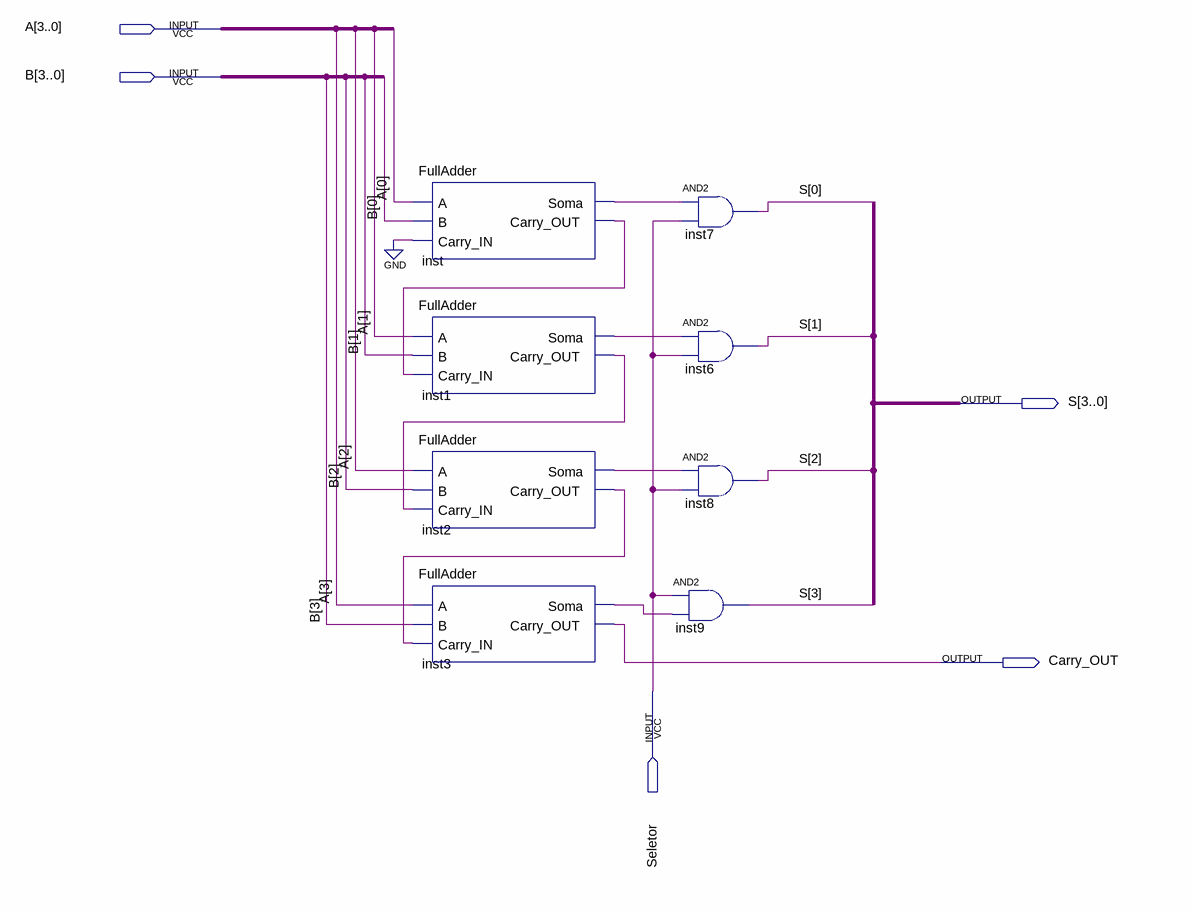
[diagram p0: schematic sheet]
// Quartus schematic Soma_4_bits.bdf as structural Verilog: 8 symbols, 5 pins
module Soma_4_bits (
  input  [3:0] A,
  input  [3:0] B,
  input  Seletor,
  output [3:0] S,
  output Carry_OUT
);

  wire inst1_carry_out, inst1_soma, inst2_carry_out, inst2_soma, inst3_soma, inst_carry_out, inst_soma;

  FullAdder inst (.A(A[0]), .B(B[0]), .Carry_IN(1'b0), .Soma(inst_soma), .Carry_OUT(inst_carry_out));
  FullAdder inst1 (.A(A[1]), .B(B[1]), .Carry_IN(inst_carry_out), .Soma(inst1_soma), .Carry_OUT(inst1_carry_out));
  FullAdder inst2 (.A(A[2]), .B(B[2]), .Carry_IN(inst1_carry_out), .Soma(inst2_soma), .Carry_OUT(inst2_carry_out));
  FullAdder inst3 (.A(A[3]), .B(B[3]), .Carry_IN(inst2_carry_out), .Soma(inst3_soma), .Carry_OUT(Carry_OUT));
  and inst7 (S[0], inst_soma, Seletor);
  and inst6 (S[1], inst1_soma, Seletor);
  and inst8 (S[2], inst2_soma, Seletor);
  and inst9 (S[3], Seletor, inst3_soma);
endmodule
